# Altium schematic sheet HT32F12364.SchDoc
size A3
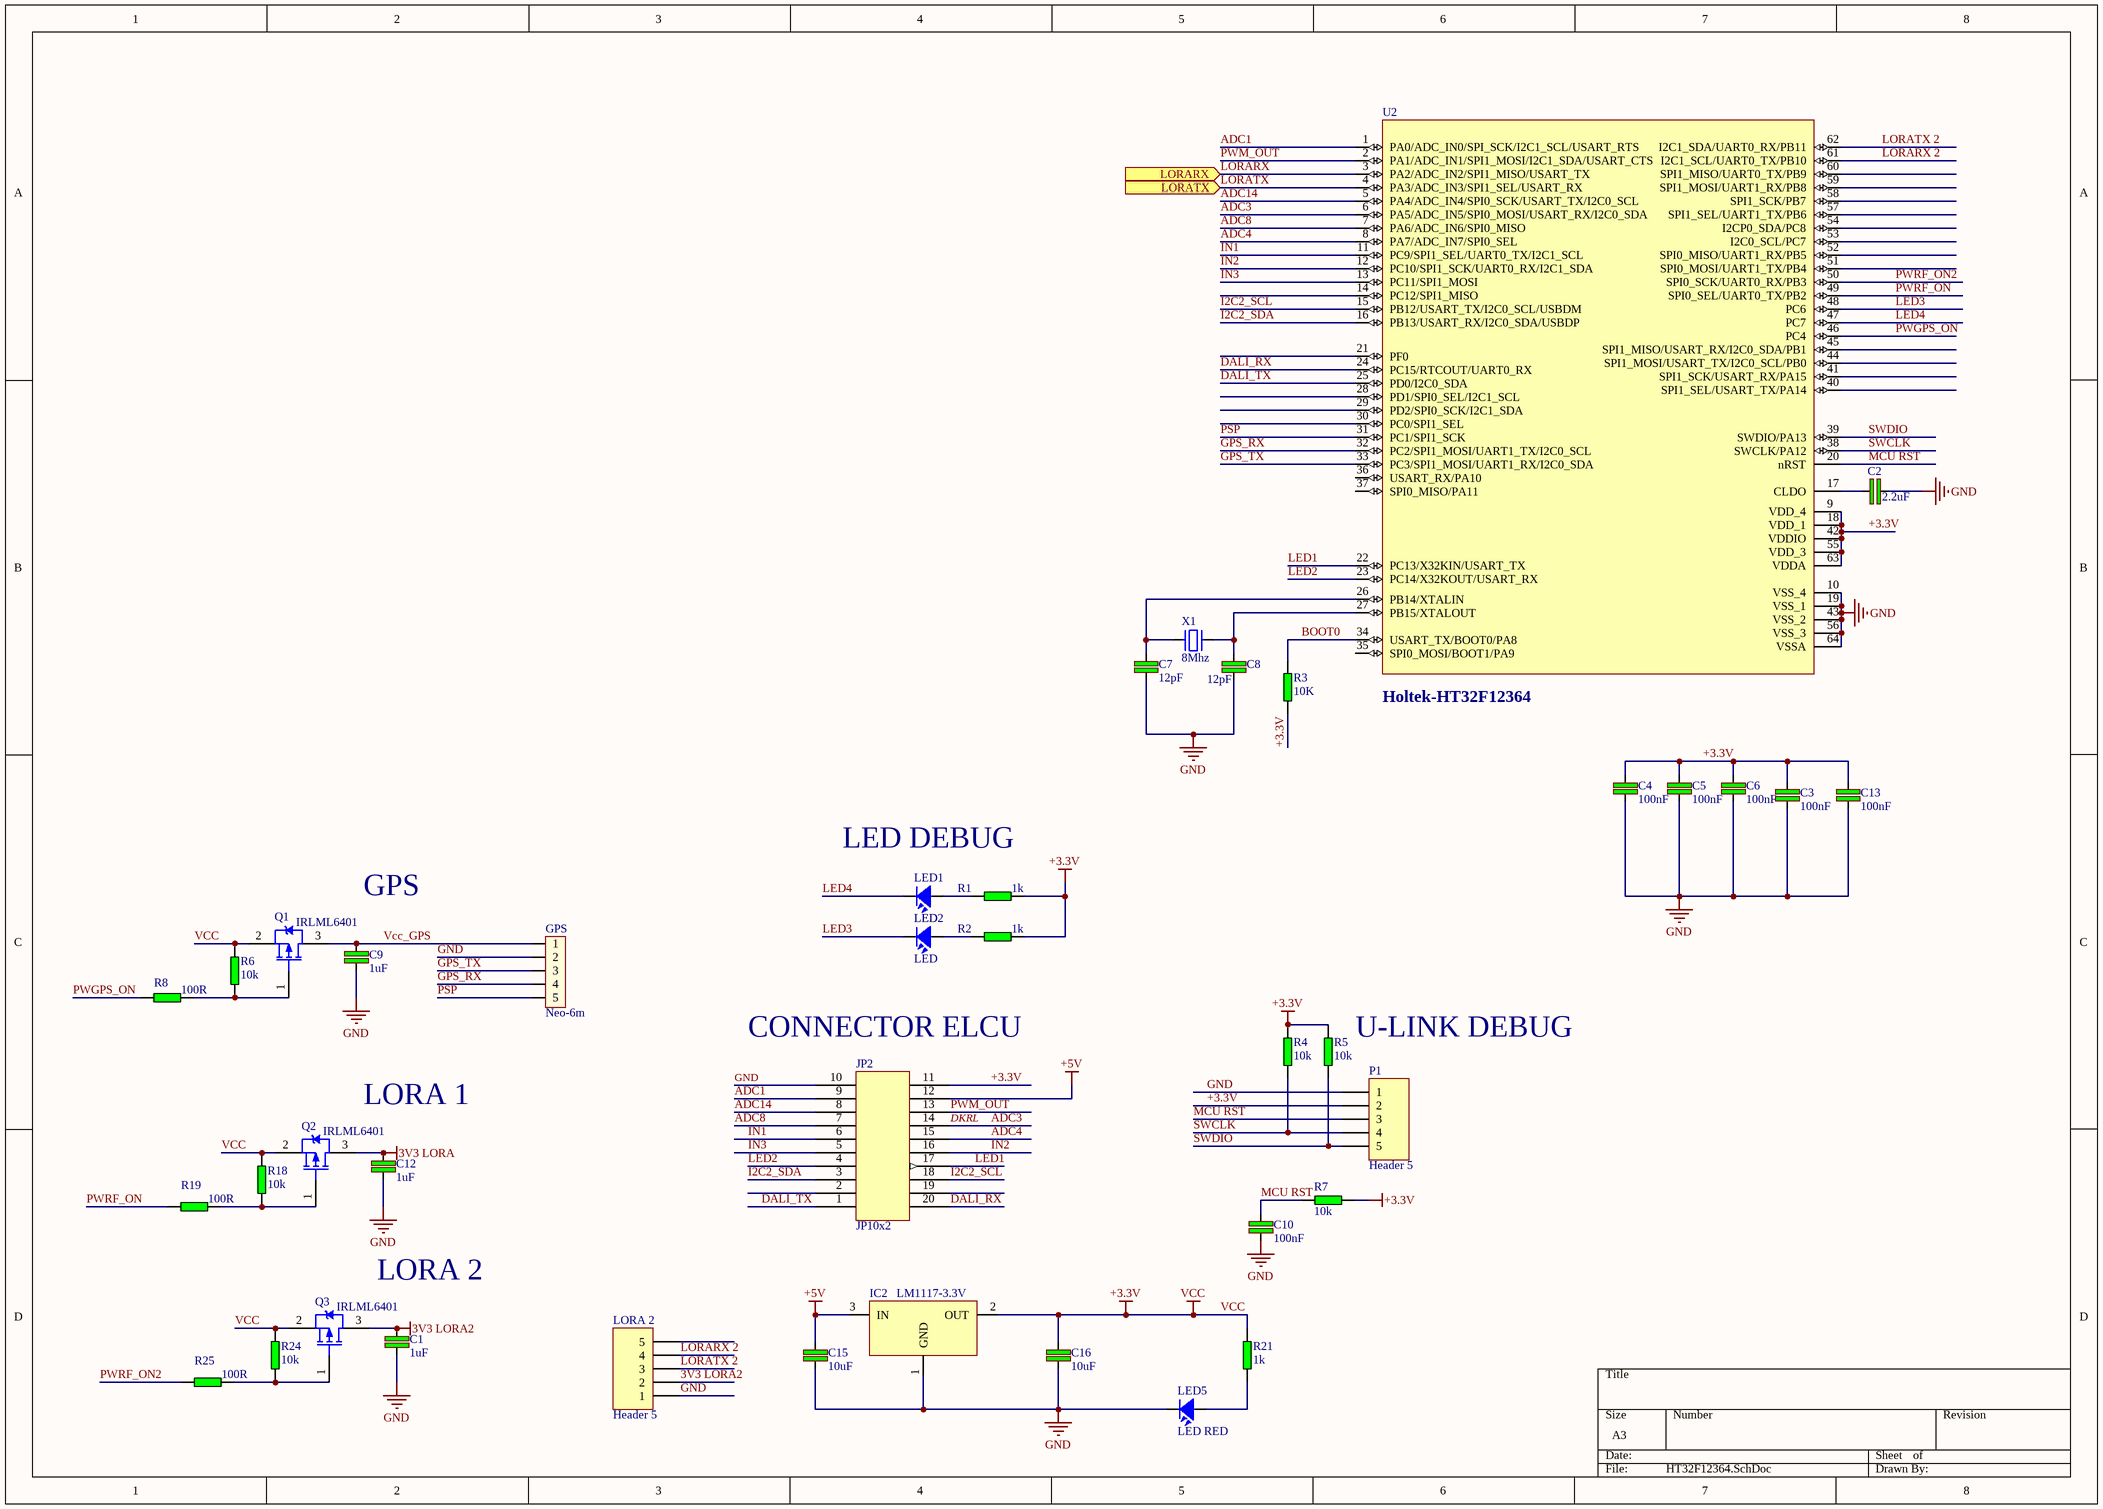
[diagram p0: HT32F12364.SchDoc]

## Parts
C1  1uF  [C-0603]
C2  2.2uF  [C-0603]
C3  100nF  [C-0603]
C4  100nF  [C-0603]
C5  100nF  [C-0603]
C6  100nF  [C-0603]
C7  12pF  [C-0603]
C8  12pF  [C-0603]
C9  1uF  [C-0603]
C10  100nF  [C-0603]
C12  1uF  [C-0603]
C13  100nF  [C-0603]
C15  10uF  [C-0805]
C16  10uF  [C-0805]
GPS  Neo-6m  [QUECTEL L80 MODULE]
IC2  LM1117-3.3V  [SOT223-4N]
JP2  JP10x2  [JP10-D2T]
LED1  LED  [LED-0805]
LED2  LED  [LED-0805]
LED5  LED RED  [LED-0805]
LORA_2  Header 5  [RAK3172 MODULE 2]
P1  Header 5  [JP5]
Q1  IRLML6401  [SOT23]
Q2  IRLML6401  [SOT23]
Q3  IRLML6401  [SOT23]
R1  1k  [R-0603]
R2  1k  [R-0603]
R3  10K  [R-0603]
R4  10k  [R-0603]
R5  10k  [R-0603]
R6  10k  [R-0603]
R7  10k  [R-0603]
R8  100R  [R-0603]
R18  10k  [R-0603]
R19  100R  [R-0603]
R21  1k  [R-0603]
R24  10k  [R-0603]
R25  100R  [R-0603]
U2  Holtek-HT32F12364  [LQFP-64PIN-7mmx7mm]
X1  8Mhz  [XT2 - DAN - 5032]

## Ports
LORARX (in), LORATX (in)

## Nets
3V3 LORA: C12.1 Q2.3(D)
3V3 LORA2: C1.1 LORA_2.2 Q3.3(D)
+3.3V: C3.1 C4.1 C5.1 C6.1 C13.1 C16.2 IC2.2(OUT) JP2.11 P1.2 Q1.2(S) Q2.2(S) Q3.2(S) R1.2 R2.2 R3.1 R4.1 R5.1 R6.2 R7.2 R18.2 R21.2 R24.2 U2.9(VDD_4) U2.18(VDD_1) U2.42(VDDIO) U2.55(VDD_3) U2.63(VDDA)  [also labelled VCC]
+5V: C15.2 IC2.3(IN) JP2.12
GND: C1.2 C2.2 C3.2 C4.2 C5.2 C6.2 C7.2 C8.2 C9.2 C10.2 C12.2 C13.2 C15.1 C16.1 GPS.2 IC2.1(GND) JP2.10 LED5.2 LORA_2.1 P1.1 U2.10(VSS_4) U2.19(VSS_1) U2.43(VSS_2) U2.56(VSS_3) U2.64(VSSA)
ADC1: JP2.9 U2.1(PA0/ADC_IN0/SPI_SCK/I2C1_SCL/USART_RTS)
ADC3: JP2.14 U2.6(PA5/ADC_IN5/SPI0_MOSI/USART_RX/I2C0_SDA)  [also labelled DKRL]
ADC4: JP2.15 U2.8(PA7/ADC_IN7/SPI0_SEL)
ADC8: JP2.7 U2.7(PA6/ADC_IN6/SPI0_MISO)
ADC14: JP2.8 U2.5(PA4/ADC_IN4/SPI0_SCK/USART_TX/I2C0_SCL)
BOOT0: R3.2 U2.34(USART_TX/BOOT0/PA8)
DALI_RX: JP2.20 U2.24(PC15/RTCOUT/UART0_RX)
DALI_TX: JP2.1 U2.25(PD0/I2C0_SDA)
GPS_RX: GPS.4 U2.32(PC2/SPI1_MOSI/UART1_TX/I2C0_SCL)
GPS_TX: GPS.3 U2.33(PC3/SPI1_MOSI/UART1_RX/I2C0_SDA)
I2C2_SCL: JP2.18 U2.15(PB12/USART_TX/I2C0_SCL/USBDM)
I2C2_SDA: JP2.3 U2.16(PB13/USART_RX/I2C0_SDA/USBDP)
IN1: JP2.6 U2.11(PC9/SPI1_SEL/UART0_TX/I2C1_SCL)
IN2: JP2.16 U2.12(PC10/SPI1_SCK/UART0_RX/I2C1_SDA)
IN3: JP2.5 U2.13(PC11/SPI1_MOSI)
LED1: JP2.17 U2.22(PC13/X32KIN/USART_TX)
LED2: JP2.4 U2.23(PC14/X32KOUT/USART_RX)
LED3: LED2.2 U2.48(PC6)
LED4: LED1.2 U2.47(PC7)
LORARX: U2.3(PA2/ADC_IN2/SPI1_MISO/USART_TX) ; port LORARX
LORARX 2: LORA_2.4 U2.61(I2C1_SCL/UART0_TX/PB10)
LORATX: U2.4(PA3/ADC_IN3/SPI1_SEL/USART_RX) ; port LORATX
LORATX 2: LORA_2.3 U2.62(I2C1_SDA/UART0_RX/PB11)
MCU RST: C10.1 P1.3 R7.1 U2.20(nRST)
PSP: GPS.5 U2.31(PC1/SPI1_SCK)
PWGPS_ON: R8.1 U2.46(PC4)
PWM_OUT: JP2.13 U2.2(PA1/ADC_IN1/SPI1_MOSI/I2C1_SDA/USART_CTS)
PWRF_ON: R19.1 U2.49(SPI0_SEL/UART0_TX/PB2)
PWRF_ON2: R25.1 U2.50(SPI0_SCK/UART0_RX/PB3)
SWCLK: P1.4 R4.2 U2.38(SWCLK/PA12)
SWDIO: P1.5 R5.2 U2.39(SWDIO/PA13)
Vcc_GPS: C9.1 GPS.1 Q1.3(D)
NetC2_1: C2.1 U2.17(CLDO)
NetC7_1: C7.1 U2.26(PB14/XTALIN) X1.1
NetC8_1: C8.1 U2.27(PB15/XTALOUT) X1.2
NetLED1_1: LED1.1 R1.1
NetLED2_1: LED2.1 R2.1
NetLED5_1: LED5.1 R21.1
NetQ1_1: Q1.1(G) R6.1 R8.2
NetQ2_1: Q2.1(G) R18.1 R19.2
NetQ3_1: Q3.1(G) R24.1 R25.2

Not connected (* = marked no-connect by the designer): JP2 2 19(21); LORA_2 5; U2 14(PC12/SPI1_MISO) 21(PF0) 28(PD1/SPI0_SEL/I2C1_SCL) 29(PD2/SPI0_SCK/I2C1_SDA) 30(PC0/SPI1_SEL) 35(SPI0_MOSI/BOOT1/PA9) 36(USART_RX/PA10) 37(SPI0_MISO/PA11) 40(SPI1_SEL/USART_TX/PA14) 41(SPI1_SCK/USART_RX/PA15) 44(SPI1_MOSI/USART_TX/I2C0_SCL/PB0) 45(SPI1_MISO/USART_RX/I2C0_SDA/PB1) 51(SPI0_MOSI/UART1_TX/PB4) 52(SPI0_MISO/UART1_RX/PB5) 53(I2C0_SCL/PC7) 54(I2CP0_SDA/PC8) 57(SPI1_SEL/UART1_TX/PB6) 58(SPI1_SCK/PB7) 59(SPI1_MOSI/UART1_RX/PB8) 60(SPI1_MISO/UART0_TX/PB9)

## Notes on the sheet
- LED DEBUG
- GPS
- (near JP2) CONNECTOR ELCU
- (near R5) U-LINK DEBUG
- LORA 1
- LORA 2

## Library data of the parts
C1-C10 C12 C13 = C: Cap SMD; Value: 103
C15 C16 = CAP: Cap np  1pF - 472pF; Value: 100nF
GPS = JP5
IC2 = LM1117: Creator: Nguyen Ba Bien; Website: http://group3i.net
JP2 = CON10X2: Conector 10x2
LED1 LED2 LED5 = LED: LED Single colour Green and Red; Value: LED 3 ly Single Colour
LORA_2 P1 = Header 5: Header, 5-Pin; LatestRevisionDate: 17-Jul-2002; LatestRevisionNote: Re-released for DXP Platform.; Publisher: Altium Limited
Q1-Q3 = IRLML6302: HEXFET Power MOSFET; Published: 8-Jun-2000; LatestRevisionDate: 17-Jul-2002; LatestRevisionNote: Re-released for DXP Platform.; DatasheetVersion: Aug-1997; PackageReference: SOT-23; Publisher: Altium Limited; PackageDescription: SOT-23; 3 Leads; Body 3.1 x 2.5 mm, inc. leads (LxW max); ComponentLink1Description: Manufacturer Link; ComponentLink1URL: http://www.irf.com/; ComponentLink2Description: Datasheet; ComponentLink2URL: http://www.irf.com/product-info/datasheets/data/irlml6302.pdf
R1-R8 R18 R19 R21 R24 R25 = RES: Resistor 1/4W; Value: R1/4W - 1K
U2 = Holtek-HT32F12364: http://admin.epi-tech.com.vn//files/20210803/20210803162044_HT32F12364.pdf
X1 = XT2: Crystal For all Crystal 2pin.; Value: 4Mhz